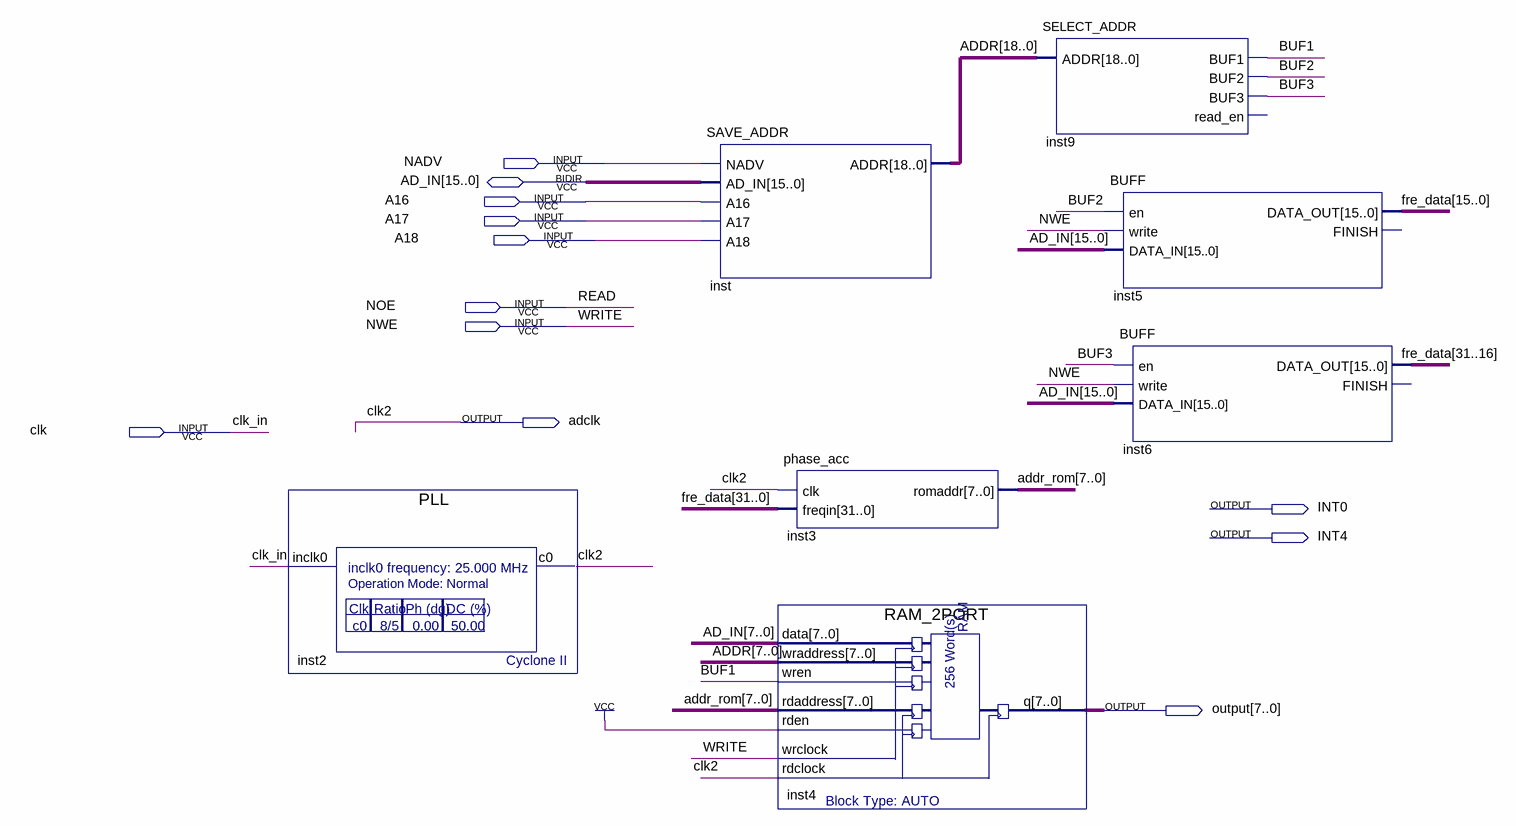
[diagram p0: schematic sheet]
// Quartus schematic FPGA_EP2C.bdf as structural Verilog: 7 symbols, 12 pins
module FPGA_EP2C (
  input  NADV,
  input  A16,
  input  A17,
  input  A18,
  input  NOE,
  input  NWE,
  input  clk,
  inout  [15:0] AD_IN,
  output adclk,
  output INT0,
  output INT4,
  output [7:0] \output 
);

  wire BUF1, BUF2, BUF3;
  wire [7:0] addr_rom;
  wire [18:0] ADDR;
  wire [31:0] fre_data;

  PLL inst2 (.inclk0(clk), .c0(adclk));
  SAVE_ADDR inst (.NADV(NADV), .AD_IN(AD_IN), .A16(A16), .A17(A17), .A18(A18), .ADDR(ADDR));
  phase_acc inst3 (.clk(adclk), .freqin(fre_data), .romaddr(addr_rom));
  RAM_2PORT inst4 (
    .data(AD_IN[7:0]), .wraddress(ADDR[7:0]), .wren(BUF1), .rdaddress(addr_rom), .rden(1'b1), .wrclock(NWE),
    .rdclock(adclk), .q(\output ));
  SELECT_ADDR inst9 (.ADDR(ADDR), .BUF1(BUF1), .BUF2(BUF2), .BUF3(BUF3));  // open: read_en
  BUFF inst5 (.en(BUF2), .write(NWE), .DATA_IN(AD_IN), .DATA_OUT(fre_data[15:0]));  // open: FINISH
  BUFF inst6 (.en(BUF3), .write(NWE), .DATA_IN(AD_IN), .DATA_OUT(fre_data[31:16]));  // open: FINISH

  // Other names for the same wires on the sheet: clk2 = adclk; clk_in = clk; READ = NOE; WRITE = NWE
endmodule
